# Altium schematic sheet BatteryMonitor.SchDoc
size A4; SheetNumber: 13; SheetTotal: 13
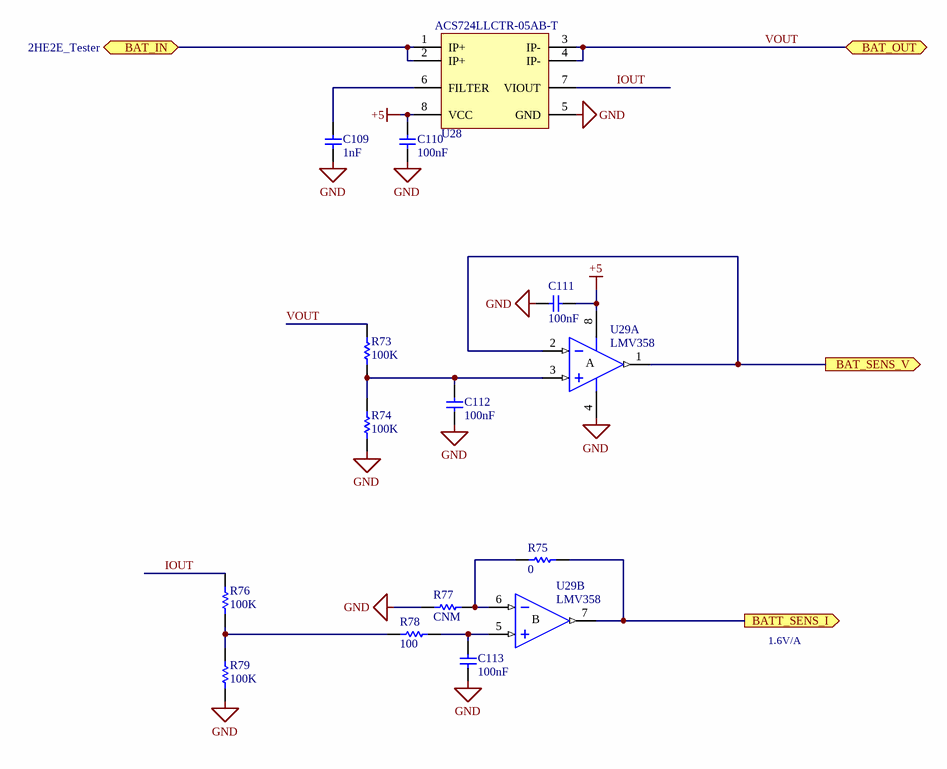
[diagram p0: BatteryMonitor.SchDoc]

## Parts
C109  value 1nF  [0603M]  (hidden comment: Cap Ceramic)
C110  value 100nF  [0603M]  (hidden comment: Cap Ceramic)
C111  value 100nF  [0603M]  (hidden comment: Cap Ceramic)
C112  value 100nF  [0603M]  (hidden comment: Cap Ceramic)
C113  value 100nF  [0603M]  (hidden comment: Cap Ceramic)
R73  value 100K  [0603M]  (hidden comment: Resistor)
R74  value 100K  [0603M]  (hidden comment: Resistor)
R75  value 0  [0603M]  (hidden comment: Resistor)
R76  value 100K  [0603M]  (hidden comment: Resistor)
R77  value CNM  [0603M]  (hidden comment: Resistor)
R78  value 100  [0603M]  (hidden comment: Resistor)
R79  value 100K  [0603M]  (hidden comment: Resistor)
U28  ACS724LLCTR-05AB-T  [SOIC127P600-8N]
U29  LMV358  [SOIC127P600-8N]  (parts A,B of 2)

## Ports
BAT_IN (bidir, see 2HE2E_Tester), BAT_OUT (bidir, see 2HE2E_Tester), BAT_SENS_V (out, see 2HE2E_Tester), BATT_SENS_I (out, see 2HE2E_Tester)

## Nets
+5: C110.2 C111.2 U28.8(VCC) U29.8(V+)
GND: C109.1 C110.1 C111.1 C112.1 C113.1 R74.1 R77.2 R79.2 U28.5(GND) U29.4(GND)
BAT_IN: U28.1(IP+) U28.2(IP+) ; port BAT_IN
BAT_SENS_V: U29.1(OUT) U29.2(IN-) ; port BAT_SENS_V
BATT_SENS_I: R75.1 U29.7(OUT) ; port BATT_SENS_I
IOUT: R76.1 U28.7(VIOUT)
VOUT: R73.2 U28.3(IP-) U28.4(IP-) ; port BAT_OUT
NetC109_2: C109.2 U28.6(FILTER)
NetC112_2: C112.2 R73.1 R74.2 U29.3(IN+)
NetC113_2: C113.2 R78.1 U29.5(IN+)
NetR75_2: R75.2 R77.1 U29.6(IN-)
NetR76_2: R76.2 R78.2 R79.1

## Notes on the sheet
- 1.6V/A
- Title
- Size:
- Date:
- A4
- Number:
- Time:
- Revision:
- Sheet
- of
- File:
- (in symbol LMV358, part A) A
- (in symbol LMV358, part B) B

## Library data of the parts
C109-C113 = Cap Ceramic: Ceramic Capacitor 25V
U28 = ACS724LLCTR-xxxx: Automotive-Grade, Galvanically Isolated Current Sensor IC with Common-Mode Field Rejection
U29 = LMV358: Dual Operational Amplifier Single Supply Rail to Rail; DatasheetDocument: Jan-1999; PackageDocument: Jul-1998; Publisher: Altium Limited; Code_JEDEC: MS-012-AA; Code_IPC: SO8; ComponentLink1Description: Manufacturer Link; ComponentLink1URL: http://www.st.com/; ComponentLink2Description: Datasheet; ComponentLink2URL: http://www.st.com/stonline/products/literature/ds/2300/tl082.pdf